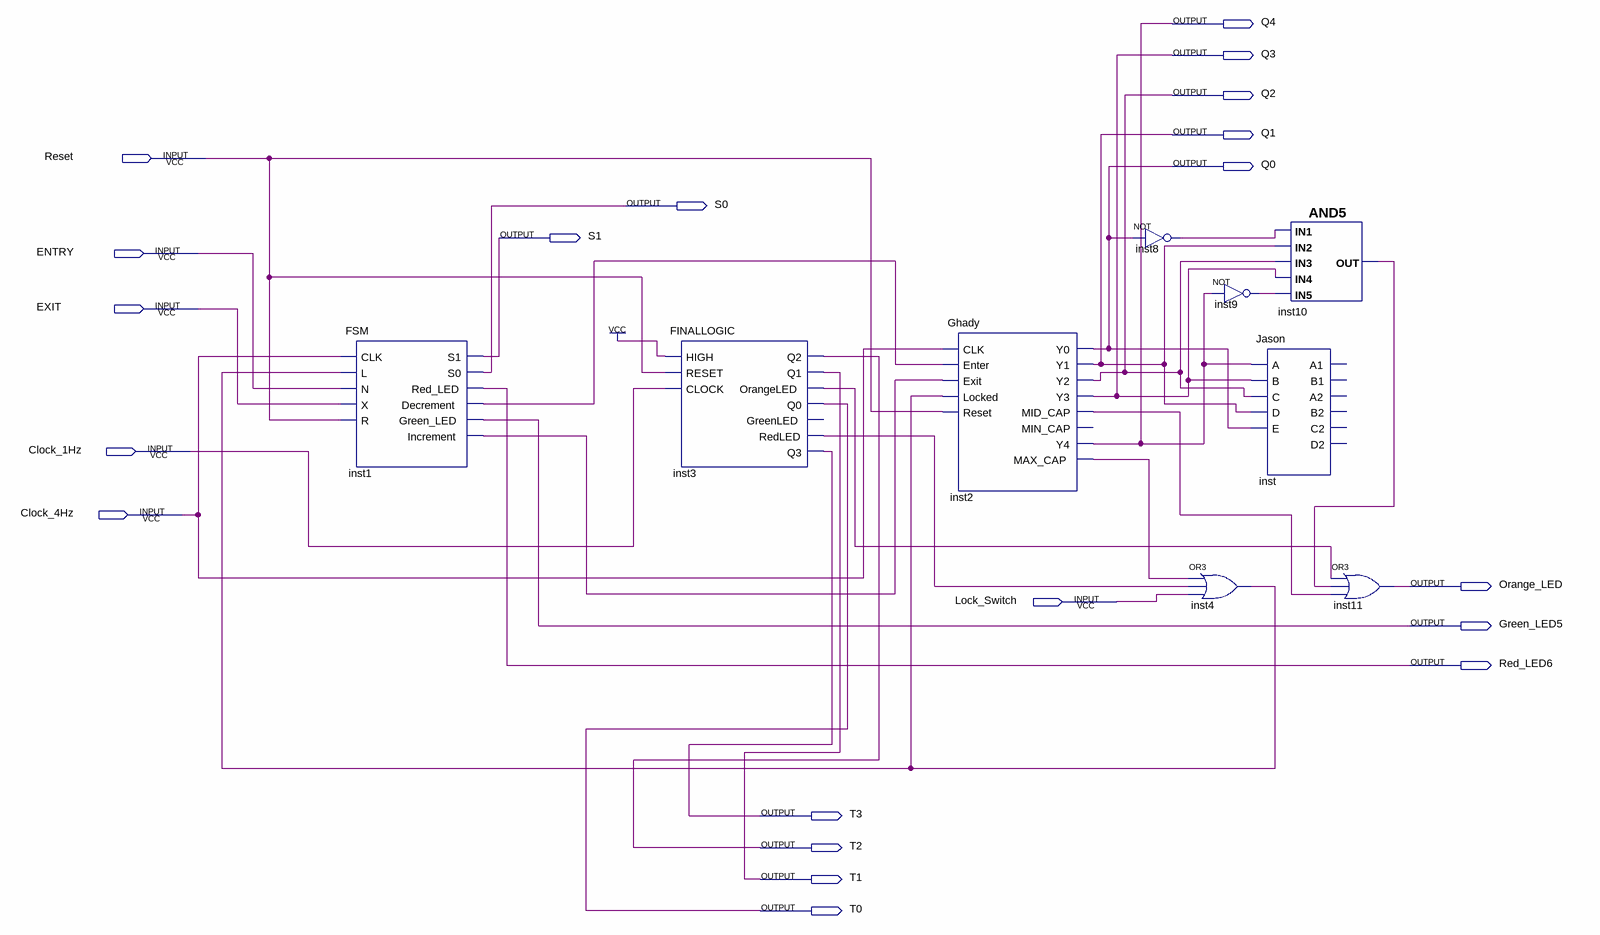
[diagram p0: schematic sheet]
// Quartus schematic Final.bdf as structural Verilog: 9 symbols, 20 pins
module Final (
  input  Reset,
  input  ENTRY,
  input  EXIT,
  input  Clock_1Hz,
  input  Clock_4Hz,
  input  Lock_Switch,
  output Q4,
  output Q3,
  output Q2,
  output Q1,
  output Q0,
  output S0,
  output S1,
  output Orange_LED,
  output Green_LED5,
  output Red_LED6,
  output T3,
  output T2,
  output T1,
  output T0
);

  wire inst1_decrement, inst1_increment, inst2_max_cap, inst2_mid_cap, inst3_orangeled, inst3_redled,
       inst4_out, inst8_out, inst9_out, inst10_out;

  FSM inst1 (
    .CLK(Clock_4Hz), .L(inst4_out), .N(ENTRY), .X(EXIT), .R(Reset), .S1(S1), .S0(S0), .Red_LED(Red_LED6),
    .Decrement(inst1_decrement), .Green_LED(Green_LED5), .Increment(inst1_increment));
  FINALLOGIC inst3 (
    .HIGH(1'b1), .RESET(Reset), .CLOCK(Clock_1Hz), .Q2(T2), .Q1(T1), .OrangeLED(inst3_orangeled), .Q0(T0),
    .RedLED(inst3_redled), .Q3(T3));  // open: GreenLED
  Ghady inst2 (
    .CLK(Clock_4Hz), .Enter(inst1_decrement), .Exit(inst1_increment), .Locked(inst4_out), .Reset(Reset),
    .Y0(Q0), .Y1(Q1), .Y2(Q2), .Y3(Q3), .MID_CAP(inst2_mid_cap), .Y4(Q4), .MAX_CAP(inst2_max_cap));  // open: MIN_CAP
  not inst8 (inst8_out, Q0);
  not inst9 (inst9_out, Q4);
  or inst4 (inst4_out, inst2_max_cap, inst3_redled, Lock_Switch);
  and inst10 (inst10_out, inst8_out, Q1, Q2, Q3, inst9_out);
  Jason inst (.A(Q4), .B(Q3), .C(Q2), .D(Q1), .E(Q0));  // open: A1, B1, A2, B2, C2, D2
  or inst11 (Orange_LED, inst3_orangeled, inst10_out, inst2_mid_cap);
endmodule
